# Altium project M3 ICE.PrjPcb
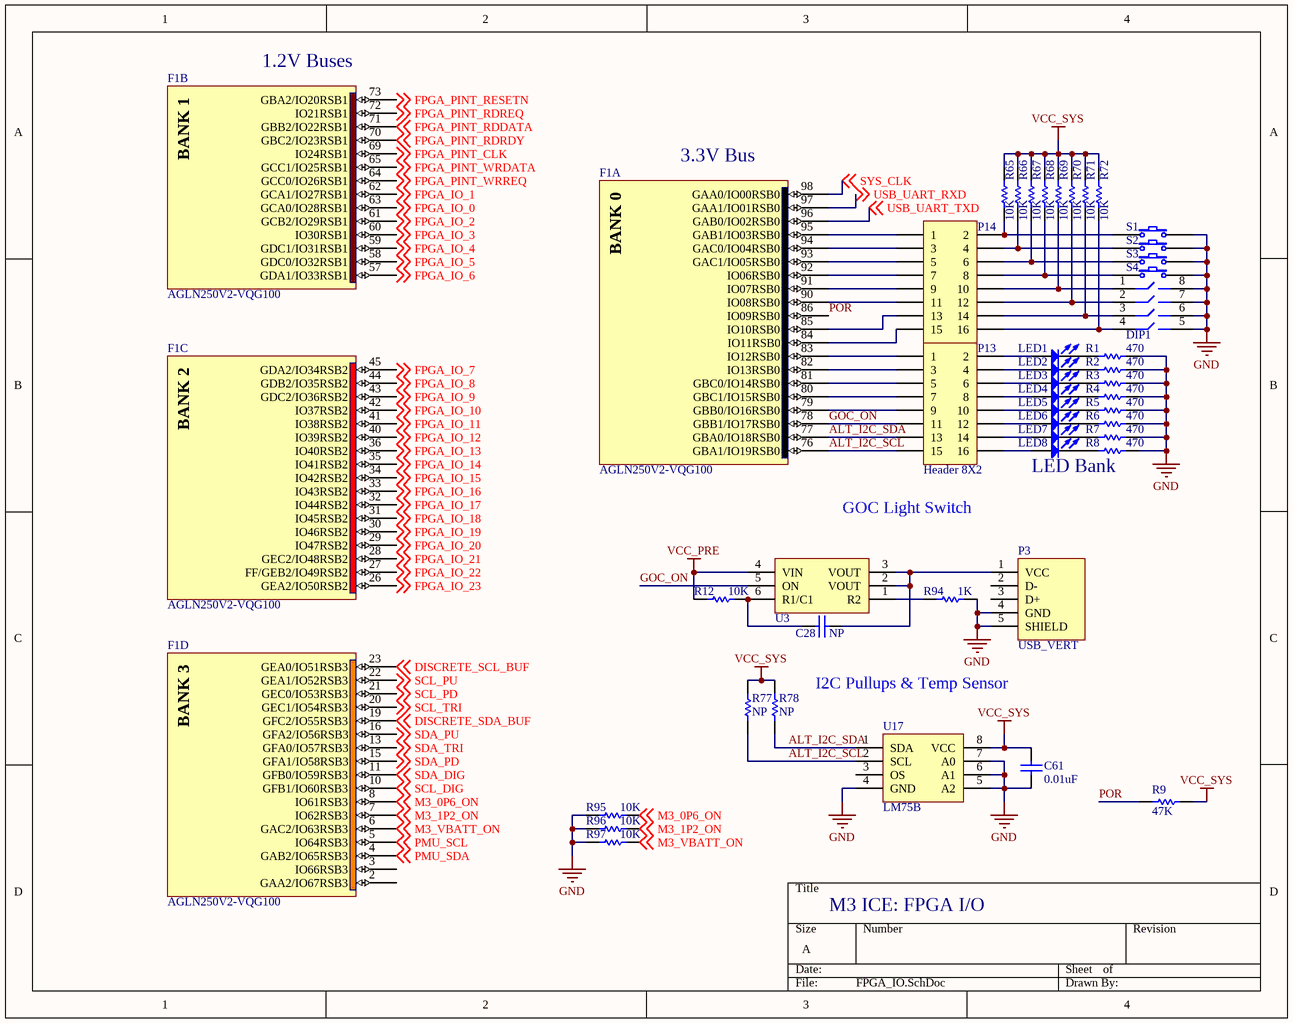
[diagram p0: FPGA_IO.SchDoc]
5 sheets, 230 parts. Net scope: global (net labels, ports and power ports of the same name join across sheets).
Board files: M3 ICE.PcbDoc, Drill Guide.PcbDoc
Sheets:
  FPGA_IO.SchDoc
  Power.SchDoc
  FPGA_misc.SchDoc
  USB_to_UART.SchDoc
  M3_Chip.SchDoc

## Sheet FPGA_IO.SchDoc
size A

### Parts
C28  value NP  [0402]  (hidden comment: Cap Semi)
C61  value 0.01uF  [1608[0603]]  (hidden comment: Cap Semi)
DIP1  ADE0404  [DIP-8]  (value not drawn)
F1  AGLN250V2-VQG100  [VQ100_N]  (parts A,B,C,D of 8)
LED1  LED 1206  [1206_LED]  (value not drawn)
LED2  LED 1206  [1206_LED]  (value not drawn)
LED3  LED 1206  [1206_LED]  (value not drawn)
LED4  LED 1206  [1206_LED]  (value not drawn)
LED5  LED 1206  [1206_LED]  (value not drawn)
LED6  LED 1206  [1206_LED]  (value not drawn)
LED7  LED 1206  [1206_LED]  (value not drawn)
LED8  LED 1206  [1206_LED]  (value not drawn)
P3  USB_VERT  [USB_VERT]
P13  Header 8X2  [HDR2X8]
P14  Header 8X2  [HDR2X8]  (value not drawn)
R1  value 470  [0603]  (hidden comment: Res Chip)
R2  value 470  [0603]  (hidden comment: Res Chip)
R3  value 470  [0603]  (hidden comment: Res Chip)
R4  value 470  [0603]  (hidden comment: Res Chip)
R5  value 470  [0603]  (hidden comment: Res Chip)
R6  value 470  [0603]  (hidden comment: Res Chip)
R7  value 470  [0603]  (hidden comment: Res Chip)
R8  value 470  [0603]  (hidden comment: Res Chip)
R9  value 47K  [0603]  (hidden comment: Res Chip)
R12  value 10K  [0402]  (hidden comment: Res Chip)
R65  value 10K  [0603]  (hidden comment: Res Chip)
R66  value 10K  [0603]  (hidden comment: Res Chip)
R67  value 10K  [0603]  (hidden comment: Res Chip)
R68  value 10K  [0603]  (hidden comment: Res Chip)
R69  value 10K  [0603]  (hidden comment: Res Chip)
R70  value 10K  [0603]  (hidden comment: Res Chip)
R71  value 10K  [0603]  (hidden comment: Res Chip)
R72  value 10K  [0603]  (hidden comment: Res Chip)
R77  value NP  [0603]  (hidden comment: Res Chip)
R78  value NP  [0603]  (hidden comment: Res Chip)
R94  value 1K  [0402]  (hidden comment: Res Chip)
R95  value 10K  [0402]  (hidden comment: Res Chip)
R96  value 10K  [0402]  (hidden comment: Res Chip)
R97  value 10K  [0402]  (hidden comment: Res Chip)
S1  EVQ-PAE04M  [EVQPA]  (value not drawn)
S2  EVQ-PAE04M  [EVQPA]  (value not drawn)
S3  EVQ-PAE04M  [EVQPA]  (value not drawn)
S4  EVQ-PAE04M  [EVQPA]  (value not drawn)
U3  FDC6330L  [SUPERSOT-6]  (value not drawn)
U17  LM75B  [SO8]

### Nets
GND: C61.1 DIP1.5 DIP1.6 DIP1.7 DIP1.8 P3.4(GND) P3.5(SHIELD) R1.1 R2.1 R3.1 R4.1 R5.1 R6.1 R7.1 R8.1 R94.2 R95.2 R96.2 R97.2 S1.2 S2.2 S3.2 S4.2 U17.4(GND) U17.5(A2) U17.6(A1) U17.7(A0)
VCC_PRE: R12.1 U3.4(VIN)
VCC_SYS: C61.2 R9.2 R65.1 R66.1 R67.1 R68.1 R69.1 R70.1 R71.1 R72.1 R77.1 R78.1 U17.8(VCC)  [project net VCC_B0]
ALT_I2C_SCL: F1.76(GBA1/IO19RSB0) P13.15 R77.2 U17.2(SCL)
ALT_I2C_SDA: F1.77(GBA0/IO18RSB0) P13.13 R78.2 U17.1(SDA)
DISCRETE_SCL_BUF: F1.23(GEA0/IO51RSB3) ; off-sheet DISCRETE_SCL_BUF
DISCRETE_SDA_BUF: F1.19(GFC2/IO55RSB3) ; off-sheet DISCRETE_SDA_BUF
FPGA_IO_0: F1.63(GCA0/IO28RSB1) ; off-sheet FPGA_IO_0
FPGA_IO_1: F1.62(GCA1/IO27RSB1) ; off-sheet FPGA_IO_1
FPGA_IO_2: F1.61(GCB2/IO29RSB1) ; off-sheet FPGA_IO_2
FPGA_IO_3: F1.60(IO30RSB1) ; off-sheet FPGA_IO_3
FPGA_IO_4: F1.59(GDC1/IO31RSB1) ; off-sheet FPGA_IO_4
FPGA_IO_5: F1.58(GDC0/IO32RSB1) ; off-sheet FPGA_IO_5
FPGA_IO_6: F1.57(GDA1/IO33RSB1) ; off-sheet FPGA_IO_6
FPGA_IO_7: F1.45(GDA2/IO34RSB2) ; off-sheet FPGA_IO_7
FPGA_IO_8: F1.44(GDB2/IO35RSB2) ; off-sheet FPGA_IO_8
FPGA_IO_9: F1.43(GDC2/IO36RSB2) ; off-sheet FPGA_IO_9
FPGA_IO_10: F1.42(IO37RSB2) ; off-sheet FPGA_IO_10
FPGA_IO_11: F1.41(IO38RSB2) ; off-sheet FPGA_IO_11
FPGA_IO_12: F1.40(IO39RSB2) ; off-sheet FPGA_IO_12
FPGA_IO_13: F1.36(IO40RSB2) ; off-sheet FPGA_IO_13
FPGA_IO_14: F1.35(IO41RSB2) ; off-sheet FPGA_IO_14
FPGA_IO_15: F1.34(IO42RSB2) ; off-sheet FPGA_IO_15
FPGA_IO_16: F1.33(IO43RSB2) ; off-sheet FPGA_IO_16
FPGA_IO_17: F1.32(IO44RSB2) ; off-sheet FPGA_IO_17
FPGA_IO_18: F1.31(IO45RSB2) ; off-sheet FPGA_IO_18
FPGA_IO_19: F1.30(IO46RSB2) ; off-sheet FPGA_IO_19
FPGA_IO_20: F1.29(IO47RSB2) ; off-sheet FPGA_IO_20
FPGA_IO_21: F1.28(GEC2/IO48RSB2) ; off-sheet FPGA_IO_21
FPGA_IO_22: F1.27(FF/GEB2/IO49RSB2) ; off-sheet FPGA_IO_22
FPGA_IO_23: F1.26(GEA2/IO50RSB2) ; off-sheet FPGA_IO_23
FPGA_PINT_CLK: F1.69(IO24RSB1) ; off-sheet FPGA_PINT_CLK
FPGA_PINT_RDDATA: F1.71(GBB2/IO22RSB1) ; off-sheet FPGA_PINT_RDDATA
FPGA_PINT_RDRDY: F1.70(GBC2/IO23RSB1) ; off-sheet FPGA_PINT_RDRDY
FPGA_PINT_RDREQ: F1.72(IO21RSB1) ; off-sheet FPGA_PINT_RDREQ
FPGA_PINT_RESETN: F1.73(GBA2/IO20RSB1) ; off-sheet FPGA_PINT_RESETN
FPGA_PINT_WRDATA: F1.65(GCC1/IO25RSB1) ; off-sheet FPGA_PINT_WRDATA
FPGA_PINT_WRREQ: F1.64(GCC0/IO26RSB1) ; off-sheet FPGA_PINT_WRREQ
GOC_ON: F1.78(GBB1/IO17RSB0) P13.11 U3.5(ON)
M3_0P6_ON: F1.8(IO61RSB3) R95.1 ; off-sheet M3_0P6_ON
M3_1P2_ON: F1.7(IO62RSB3) R96.1 ; off-sheet M3_1P2_ON
M3_VBATT_ON: F1.6(GAC2/IO63RSB3) R97.1 ; off-sheet M3_VBATT_ON
PMU_SCL: F1.5(IO64RSB3) ; off-sheet PMU_SCL
PMU_SDA: F1.4(GAB2/IO65RSB3) ; off-sheet PMU_SDA
POR: F1.86(IO09RSB0) R9.1
SCL_DIG: F1.10(GFB1/IO60RSB3) ; off-sheet SCL_DIG
SCL_PD: F1.21(GEC0/IO53RSB3) ; off-sheet SCL_PD
SCL_PU: F1.22(GEA1/IO52RSB3) ; off-sheet SCL_PU
SCL_TRI: F1.20(GEC1/IO54RSB3) ; off-sheet SCL_TRI
SDA_DIG: F1.11(GFB0/IO59RSB3) ; off-sheet SDA_DIG
SDA_PD: F1.15(GFA1/IO58RSB3) ; off-sheet SDA_PD
SDA_PU: F1.16(GFA2/IO56RSB3) ; off-sheet SDA_PU
SDA_TRI: F1.13(GFA0/IO57RSB3) ; off-sheet SDA_TRI
SYS_CLK: F1.98(GAA0/IO00RSB0) ; off-sheet SYS_CLK
USB_UART_RXD: F1.97(GAA1/IO01RSB0) ; off-sheet USB_UART_RXD
USB_UART_TXD: F1.96(GAB0/IO02RSB0) ; off-sheet USB_UART_TXD
NetC28_1: C28.1 P3.1(VCC) U3.2(VOUT) U3.3(VOUT)
NetC28_2: C28.2 R12.2 U3.6(R1/C1)
NetDIP1_1: DIP1.1 P14.10 R69.2
NetDIP1_2: DIP1.2 P14.12 R70.2
NetDIP1_3: DIP1.3 P14.14 R71.2
NetDIP1_4: DIP1.4 P14.16 R72.2
NetF1_79: F1.79(GBB0/IO16RSB0) P13.9
NetF1_80: F1.80(GBC1/IO15RSB0) P13.7
NetF1_81: F1.81(GBC0/IO14RSB0) P13.5
NetF1_82: F1.82(IO13RSB0) P13.3
NetF1_83: F1.83(IO12RSB0) P13.1
NetF1_84: F1.84(IO11RSB0) P14.15
NetF1_85: F1.85(IO10RSB0) P14.13
NetF1_90: F1.90(IO08RSB0) P14.11
NetF1_91: F1.91(IO07RSB0) P14.9
NetF1_92: F1.92(IO06RSB0) P14.7
NetF1_93: F1.93(GAC1/IO05RSB0) P14.5
NetF1_94: F1.94(GAC0/IO04RSB0) P14.3
NetF1_95: F1.95(GAB1/IO03RSB0) P14.1
NetLED1_1: LED1.1(A) P13.2
NetLED1_2: LED1.2(K) R1.2
NetLED2_1: LED2.1(A) P13.4
NetLED2_2: LED2.2(K) R2.2
NetLED3_1: LED3.1(A) P13.6
NetLED3_2: LED3.2(K) R3.2
NetLED4_1: LED4.1(A) P13.8
NetLED4_2: LED4.2(K) R4.2
NetLED5_1: LED5.1(A) P13.10
NetLED5_2: LED5.2(K) R5.2
NetLED6_1: LED6.1(A) P13.12
NetLED6_2: LED6.2(K) R6.2
NetLED7_1: LED7.1(A) P13.14
NetLED7_2: LED7.2(K) R7.2
NetLED8_1: LED8.1(A) P13.16
NetLED8_2: LED8.2(K) R8.2
NetP14_2: P14.2 R65.2 S1.1
NetP14_4: P14.4 R66.2 S2.1
NetP14_6: P14.6 R67.2 S3.1
NetP14_8: P14.8 R68.2 S4.1
NetR94_1: R94.1 U3.1(R2)

Not connected (* = marked no-connect by the designer): F1 2(GAA2/IO67RSB3) 3(IO66RSB3); P3 2(D-) 3(D+); U17 3(OS)

### Notes on the sheet
- (near F1) 1.2V Buses
- (near F1) 3.3V Bus
- LED Bank
- GOC Light Switch
- I2C Pullups & Temp Sensor
- M3 ICE: FPGA I/O
- (in symbol AGLN250V2-VQG100, part A) BANK 0
- (in symbol AGLN250V2-VQG100, part B) BANK 1
- (in symbol AGLN250V2-VQG100, part C) BANK 2
- (in symbol AGLN250V2-VQG100, part D) BANK 3

### Library data of the parts
C28 = Cap Semi: Capacitor (Semiconductor SIM Model); Published: 8-Jun-2000; LatestRevisionDate: 29-May-2009; LatestRevisionNote: IPC-7351 Footprint Added.; PackageReference: C1206; Publisher: Altium Limited; PackageDescription: Chip Capacitor
C61 = Cap Semi: Capacitor (Semiconductor SIM Model); DistPartNo: 445-1311-1-ND; ManPartNo: C1608X7R1H103K; Published: 8-Jun-2000; LatestRevisionDate: 29-May-2009; LatestRevisionNote: IPC-7351 Footprint Added.; PackageReference: C1206; Publisher: Altium Limited; PackageDescription: Chip Capacitor
DIP1 = ADE0404: 4-DIP Switch; DistPartNo: 450-1364-ND; PackageReference: DIP-8; ManPartNo: ADE0404
F1 = AGLN250V2-VQG100: IGLOO nano Low-Power Flash 1.2 to 1.5V FPGA with Flash*Freeze, 68 User IOs, 250K System Gates, 1Kbit Flash ROM, 100-Pin TQFP, Commercial Grade, Pb-Free; DistPartNo: 1100-1134-ND; Published: 29-May-2009; DatasheetVersion: Feb-2009; PackageVersion: v11.0, Feb-2009; PackageReference: VQ100; Publisher: Altium Limited; PackageDescription: 100-Pin Plastic Quad Flat Pack (VQ100); Code_JEDEC: MS-026-AED; ComponentLink1Description: Manufacturer Link; ComponentLink1URL: http://www.actel.com/products/igloonano/default.aspx; ComponentLink2Description: Datasheet; ComponentLink2URL: http://www.actel.com/documents/IGLOO_nano_DS.pdf; ManPartNo: AGLN250V2-VQG100
LED1-LED8 = LED 1206: DistPartNo: 160-1169-1-ND; ManPartNo: LTST-C150GKT
P3 = USB_VERT: DistPartNo: ED2987-ND; ManPartNo: USB-A1VSW6
P13 P14 = Header 8X2: Header, 8-Pin, Dual row; LatestRevisionDate: 17-Jul-2002; LatestRevisionNote: Re-released for DXP Platform.; Publisher: Altium Limited
R1-R8 = Res Chip: Semiconductor Resistor; DistPartNo: P470GCT-ND; ManPartNo: ERJ-3GEYJ471V; Published: 8-Jun-2000; LatestRevisionDate: 17-Jul-2002; LatestRevisionNote: Re-released for DXP Platform.; PackageReference: AXIAL-0.5; Publisher: Altium Limited; PackageDescription: Axial Device, Thru-Hole; 2 Leads; 0.5 in Pin Spacing
R9 = Res Chip: Semiconductor Resistor; DistPartNo: P47KGCT-ND; ManPartNo: ERJ-3GEYJ103V; Published: 8-Jun-2000; LatestRevisionDate: 17-Jul-2002; LatestRevisionNote: Re-released for DXP Platform.; PackageReference: AXIAL-0.5; Publisher: Altium Limited; PackageDescription: Axial Device, Thru-Hole; 2 Leads; 0.5 in Pin Spacing
R12 = Res Chip: Semiconductor Resistor; ManPartNo: ERJ-2RKF1002X; DistPartNo: P10.0KLCT-ND; Published: 8-Jun-2000; LatestRevisionDate: 17-Jul-2002; LatestRevisionNote: Re-released for DXP Platform.; PackageReference: AXIAL-0.5; Publisher: Altium Limited; PackageDescription: Axial Device, Thru-Hole; 2 Leads; 0.5 in Pin Spacing
R65-R72 = Res Chip: Semiconductor Resistor; DistPartNo: P10KGCT-ND; ManPartNo: ERJ-3GEYJ103V; Published: 8-Jun-2000; LatestRevisionDate: 17-Jul-2002; LatestRevisionNote: Re-released for DXP Platform.; PackageReference: AXIAL-0.5; Publisher: Altium Limited; PackageDescription: Axial Device, Thru-Hole; 2 Leads; 0.5 in Pin Spacing
R77 R78 = Res Chip: Semiconductor Resistor; DistPartNo: NONE; Published: 8-Jun-2000; LatestRevisionDate: 17-Jul-2002; LatestRevisionNote: Re-released for DXP Platform.; PackageReference: AXIAL-0.5; Publisher: Altium Limited; PackageDescription: Axial Device, Thru-Hole; 2 Leads; 0.5 in Pin Spacing; ManPartNo: NONE
R94 = Res Chip: Semiconductor Resistor; ManPartNo: ERJ-2RKF1001X; DistPartNo: P1.00KLCT-ND; Published: 8-Jun-2000; LatestRevisionDate: 17-Jul-2002; LatestRevisionNote: Re-released for DXP Platform.; PackageReference: AXIAL-0.5; Publisher: Altium Limited; PackageDescription: Axial Device, Thru-Hole; 2 Leads; 0.5 in Pin Spacing
R95-R97 = Res Chip: Semiconductor Resistor; DistPartNo: P10.0KLCT-ND; ManPartNo: ERJ-2RKF1002X; Published: 8-Jun-2000; LatestRevisionDate: 17-Jul-2002; LatestRevisionNote: Re-released for DXP Platform.; PackageReference: AXIAL-0.5; Publisher: Altium Limited; PackageDescription: Axial Device, Thru-Hole; 2 Leads; 0.5 in Pin Spacing
S1-S4 = EVQ-PAE04M: Switch Push; DistPartNo: P8008S-ND; ManPartNo: EVQ-PAE04M
U3 = FDC6330L: HS Switch; DistPartNo: FDC6330LCT-ND; ManPartNo: FDC6330L
U17 = LM75B: I2C Temp Sensor; DistPartNo: 568-4688-1-ND; ManPartNo: LM75BD,118

## Sheet Power.SchDoc
size A
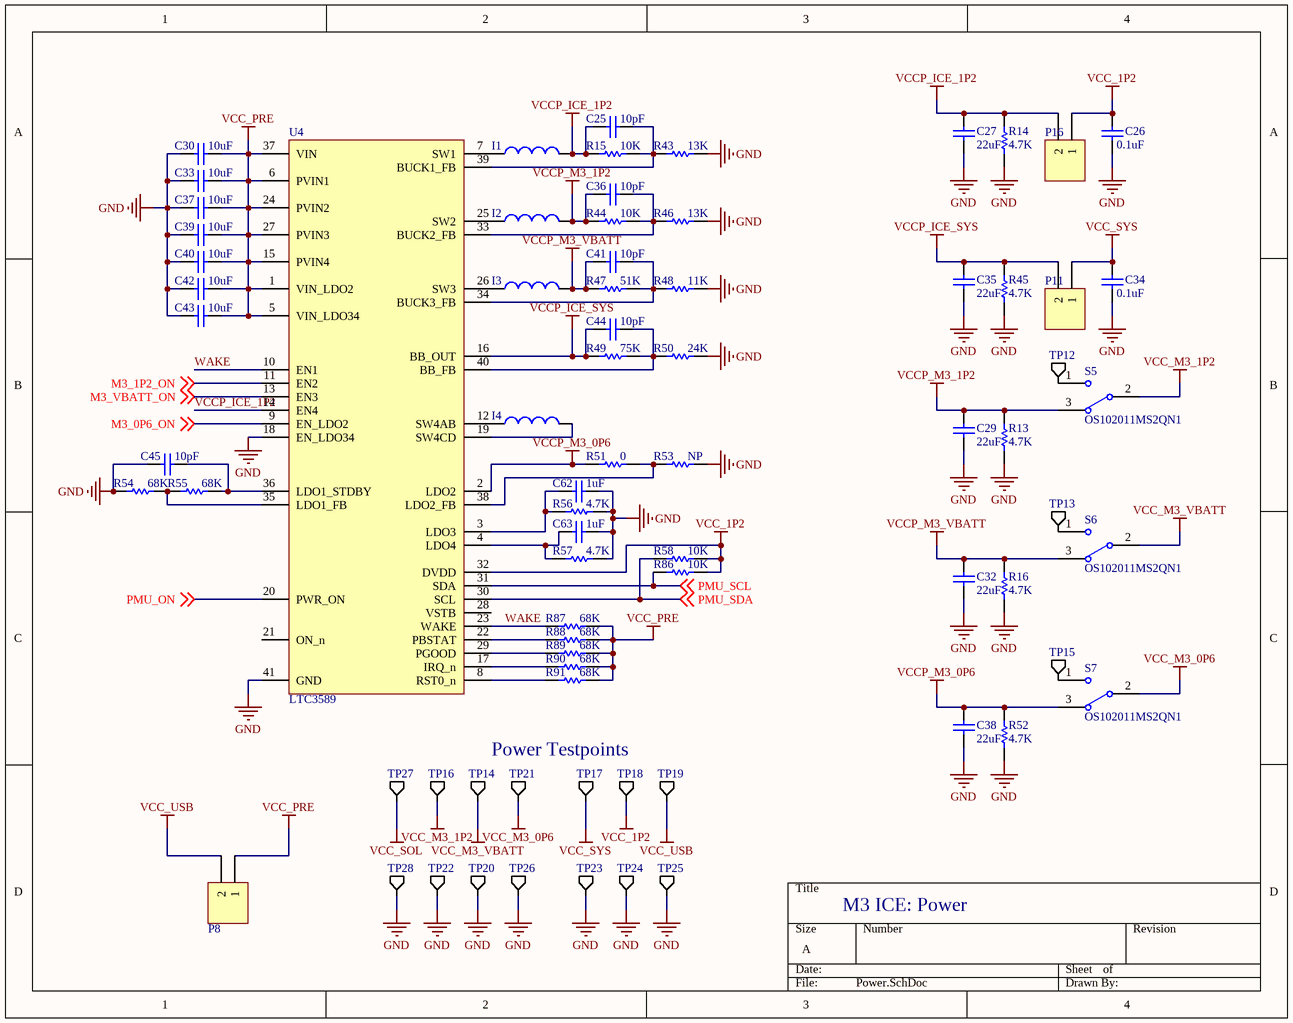
[diagram p1: Power.SchDoc]

### Parts
C25  value 10pF  [0402]  (hidden comment: Cap Semi)
C26  value 0.1uF  [1608[0603]]  (hidden comment: Cap Semi)
C27  value 22uF  [0805]  (hidden comment: Cap Chip)
C29  value 22uF  [0805]  (hidden comment: Cap Chip)
C30  value 10uF  [0805]  (hidden comment: Cap Chip)
C32  value 22uF  [0805]  (hidden comment: Cap Chip)
C33  value 10uF  [0805]  (hidden comment: Cap Chip)
C34  value 0.1uF  [1608[0603]]  (hidden comment: Cap Semi)
C35  value 22uF  [0805]  (hidden comment: Cap Chip)
C36  value 10pF  [0402]  (hidden comment: Cap Semi)
C37  value 10uF  [0805]  (hidden comment: Cap Chip)
C38  value 22uF  [0805]  (hidden comment: Cap Chip)
C39  value 10uF  [0805]  (hidden comment: Cap Chip)
C40  value 10uF  [0805]  (hidden comment: Cap Chip)
C41  value 10pF  [0402]  (hidden comment: Cap Semi)
C42  value 10uF  [0805]  (hidden comment: Cap Chip)
C43  value 10uF  [0805]  (hidden comment: Cap Chip)
C44  value 10pF  [0402]  (hidden comment: Cap Semi)
C45  value 10pF  [0402]  (hidden comment: Cap Semi)
C62  value 1uF  [0402]  (hidden comment: Cap Semi)
C63  value 1uF  [0402]  (hidden comment: Cap Semi)
I1  NR5040T1R5N  [INDUCTOR_.118x.142mm]  (value not drawn)
I2  NR5040T1R5N  [INDUCTOR_.118x.142mm]  (value not drawn)
I3  NR5040T1R5N  [INDUCTOR_.118x.142mm]  (value not drawn)
I4  NR5040T1R5N  [INDUCTOR_.118x.142mm]  (value not drawn)
P8  Header 2  [HDR1X2]  (value not drawn)
P11  Header 2  [HDR1X2]  (value not drawn)
P16  Header 2  [HDR1X2]  (value not drawn)
R13  value 4.7K  [0603]  (hidden comment: Res Chip)
R14  value 4.7K  [0603]  (hidden comment: Res Chip)
R15  value 10K  [0402]  (hidden comment: Res Chip)
R16  value 4.7K  [0603]  (hidden comment: Res Chip)
R43  value 13K  [0402]  (hidden comment: Res Chip)
R44  value 10K  [0402]  (hidden comment: Res Chip)
R45  value 4.7K  [0603]  (hidden comment: Res Chip)
R46  value 13K  [0402]  (hidden comment: Res Chip)
R47  value 51K  [0402]  (hidden comment: Res Chip)
R48  value 11K  [0402]  (hidden comment: Res Chip)
R49  value 75K  [0402]  (hidden comment: Res Chip)
R50  value 24K  [0402]  (hidden comment: Res Chip)
R51  value 0  [0402]  (hidden comment: Res Chip)
R52  value 4.7K  [0603]  (hidden comment: Res Chip)
R53  value NP  [0402]  (hidden comment: Res Chip)
R54  value 68K  [0402]  (hidden comment: Res Chip)
R55  value 68K  [0402]  (hidden comment: Res Chip)
R56  value 4.7K  [0402]  (hidden comment: Res Chip)
R57  value 4.7K  [0402]  (hidden comment: Res Chip)
R58  value 10K  [0402]  (hidden comment: Res Chip)
R86  value 10K  [0402]  (hidden comment: Res Chip)
R87  value 68K  [0402]  (hidden comment: Res Chip)
R88  value 68K  [0402]  (hidden comment: Res Chip)
R89  value 68K  [0402]  (hidden comment: Res Chip)
R90  value 68K  [0402]  (hidden comment: Res Chip)
R91  value 68K  [0402]  (hidden comment: Res Chip)
S5  OS102011MS2QN1  [SPDT_SW2]
S6  OS102011MS2QN1  [SPDT_SW2]
S7  OS102011MS2QN1  [SPDT_SW2]
TP12  TP  [TP]  (value not drawn)
TP13  TP  [TP]  (value not drawn)
TP14  TP  [TP]  (value not drawn)
TP15  TP  [TP]  (value not drawn)
TP16  TP  [TP]  (value not drawn)
TP17  TP  [TP]  (value not drawn)
TP18  TP  [TP]  (value not drawn)
TP19  TP  [TP]  (value not drawn)
TP20  TP  [TP]  (value not drawn)
TP21  TP  [TP]  (value not drawn)
TP22  TP  [TP]  (value not drawn)
TP23  TP  [TP]  (value not drawn)
TP24  TP  [TP]  (value not drawn)
TP25  TP  [TP]  (value not drawn)
TP26  TP  [TP]  (value not drawn)
TP27  TP  [TP]  (value not drawn)
TP28  TP  [TP]  (value not drawn)
U4  LTC3589  [QFN-40]

### Nets
GND: C26.1 C27.1 C29.1 C30.2 C32.1 C33.2 C34.1 C35.1 C37.2 C38.1 C39.2 C40.2 C42.2 C43.2 C45.2 C62.1 C63.1 R13.1 R14.1 R16.1 R43.2 R45.1 R46.2 R48.2 R50.2 R52.1 R53.2 R54.1 R56.2 R57.2 TP20.1(A) TP22.1(A) TP23.1(A) TP24.1(A) TP25.1(A) TP26.1(A) TP28.1(A) U4.18(EN_LDO34) U4.41(GND)
VCC_1P2: C26.2 P16.1 R58.2 R86.2 TP18.1(A) U4.32(DVDD)
VCC_M3_0P6: S7.2 TP21.1(A)
VCC_M3_1P2: S5.2 TP16.1(A)
VCC_M3_VBATT: S6.2 TP14.1(A)
VCC_PRE: C30.1 C33.1 C37.1 C39.1 C40.1 C42.1 C43.1 P8.1 R87.2 R88.2 R89.2 R90.2 R91.2 U4.1(VIN_LDO2) U4.5(VIN_LDO34) U4.6(PVIN1) U4.15(PVIN4) U4.24(PVIN2) U4.27(PVIN3) U4.37(VIN)
VCC_SOL: TP27.1(A)
VCC_SYS: C34.2 P11.1 TP17.1(A)  [project net VCC_B0]
VCC_USB: P8.2 TP19.1(A)
VCCP_ICE_1P2: C25.2 C27.2 I1.2 P16.2 R14.2 R15.1 U4.14(EN4)
VCCP_ICE_SYS: C35.2 C44.2 P11.2 R45.2 R49.1 U4.16(BB_OUT)
VCCP_M3_0P6: C38.2 R51.1 R52.2 S7.3 U4.2(LDO2)
VCCP_M3_1P2: C29.2 C36.2 I2.2 R13.2 R44.1 S5.3
VCCP_M3_VBATT: C32.2 C41.2 I3.2 R16.2 R47.1 S6.3
M3_0P6_ON: U4.9(EN_LDO2) ; off-sheet M3_0P6_ON
M3_1P2_ON: U4.11(EN2) ; off-sheet M3_1P2_ON
M3_VBATT_ON: U4.13(EN3) ; off-sheet M3_VBATT_ON
PMU_ON: U4.20(PWR_ON) ; off-sheet PMU_ON
PMU_SCL: R86.1 U4.31(SDA) ; off-sheet PMU_SCL
PMU_SDA: R58.1 U4.30(SCL) ; off-sheet PMU_SDA
WAKE: R87.1 U4.10(EN1) U4.23(WAKE)
NetC25_1: C25.1 R15.2 R43.1 U4.39(BUCK1_FB)
NetC36_1: C36.1 R44.2 R46.1 U4.33(BUCK2_FB)
NetC41_1: C41.1 R47.2 R48.1 U4.34(BUCK3_FB)
NetC44_1: C44.1 R49.2 R50.1 U4.40(BB_FB)
NetC45_1: C45.1 R55.2 U4.36(LDO1_STDBY)
NetC62_2: C62.2 R56.1 U4.3(LDO3)
NetC63_2: C63.2 R57.1 U4.4(LDO4)
NetI1_1: I1.1 U4.7(SW1)
NetI2_1: I2.1 U4.25(SW2)
NetI3_1: I3.1 U4.26(SW3)
NetI4_1: I4.1 U4.12(SW4AB)
NetI4_2: I4.2 U4.19(SW4CD)
NetR51_2: R51.2 R53.1 U4.38(LDO2_FB)
NetR54_2: R54.2 R55.1 U4.35(LDO1_FB)
NetR88_1: R88.1 U4.22(PBSTAT)
NetR89_1: R89.1 U4.29(PGOOD)
NetR90_1: R90.1 U4.17(IRQ_n)
NetR91_1: R91.1 U4.8(RST0_n)
NetS5_1: S5.1 TP12.1(A)
NetS6_1: S6.1 TP13.1(A)
NetS7_1: S7.1 TP15.1(A)

Not connected (* = marked no-connect by the designer): U4 21(ON_n) 28(VSTB)

### Notes on the sheet
- Power Testpoints
- M3 ICE: Power

### Library data of the parts
C25 C36 C41 C44 C45 = Cap Semi: Capacitor (Semiconductor SIM Model); DistPartNo: 445-1235-1-ND; ManPartNo: C1005C0G1H100D; Published: 8-Jun-2000; LatestRevisionDate: 29-May-2009; LatestRevisionNote: IPC-7351 Footprint Added.; PackageReference: C1206; Publisher: Altium Limited; PackageDescription: Chip Capacitor
C26 C34 = Cap Semi: Capacitor (Semiconductor SIM Model); DistPartNo: 445-1317-1-ND; ManPartNo: C1608X7R1C104K; Published: 8-Jun-2000; LatestRevisionDate: 29-May-2009; LatestRevisionNote: IPC-7351 Footprint Added.; PackageReference: C1206; Publisher: Altium Limited; PackageDescription: Chip Capacitor
C27 C29 C32 C35 C38 = Cap Chip: Capacitor (Semiconductor SIM Model); DistPartNo: 587-2782-1-ND; ManPartNo: LMK316AB7226ML-TR; Published: 8-Jun-2000; LatestRevisionDate: 29-May-2009; LatestRevisionNote: IPC-7351 Footprint Added.; PackageReference: C1206; Publisher: Altium Limited; PackageDescription: Chip Capacitor
C30 C33 C37 C39 C40 C42 C43 = Cap Chip: Capacitor (Semiconductor SIM Model); DistPartNo: 445-6857-1-ND; ManPartNo: C2012X7R1A106K; Published: 8-Jun-2000; LatestRevisionDate: 29-May-2009; LatestRevisionNote: IPC-7351 Footprint Added.; PackageReference: C1206; Publisher: Altium Limited; PackageDescription: Chip Capacitor
C62 C63 = Cap Semi: Capacitor (Semiconductor SIM Model); DistPartNo: 445-4991-1-ND; ManPartNo: C1005X5R1A105M; Published: 8-Jun-2000; LatestRevisionDate: 29-May-2009; LatestRevisionNote: IPC-7351 Footprint Added.; PackageReference: C1206; Publisher: Altium Limited; PackageDescription: Chip Capacitor
I1-I4 = IHLP1212: DistPartNo: 541-1327-1-ND; ManPartNo: IHLP1212AEER1R0M11
P8 P11 P16 = Header 2: Header, 2-Pin; LatestRevisionDate: 17-Jul-2002; LatestRevisionNote: Re-released for DXP Platform.; Publisher: Altium Limited
R13 R14 R16 R45 R52 = Res Chip: Semiconductor Resistor; DistPartNo: P4.7KGCT-ND; ManPartNo: ERJ-3GEYJ472V; Published: 8-Jun-2000; LatestRevisionDate: 17-Jul-2002; LatestRevisionNote: Re-released for DXP Platform.; PackageReference: AXIAL-0.5; Publisher: Altium Limited; PackageDescription: Axial Device, Thru-Hole; 2 Leads; 0.5 in Pin Spacing
R15 R44 R58 R86 = Res Chip: as R95 on sheet FPGA_IO; Published: 8-Jun-2000; LatestRevisionDate: 17-Jul-2002; LatestRevisionNote: Re-released for DXP Platform.; PackageReference: AXIAL-0.5; Publisher: Altium Limited; PackageDescription: Axial Device, Thru-Hole; 2 Leads; 0.5 in Pin Spacing
R43 R46 = Res Chip: Semiconductor Resistor; DistPartNo: 311-13.0KLRCT-ND; ManPartNo: RC0402FR-0713KL; Published: 8-Jun-2000; LatestRevisionDate: 17-Jul-2002; LatestRevisionNote: Re-released for DXP Platform.; PackageReference: AXIAL-0.5; Publisher: Altium Limited; PackageDescription: Axial Device, Thru-Hole; 2 Leads; 0.5 in Pin Spacing
R47 = Res Chip: Semiconductor Resistor; DistPartNo: P51.0KLCT-ND; ManPartNo: ERJ-2RKF5102X; Published: 8-Jun-2000; LatestRevisionDate: 17-Jul-2002; LatestRevisionNote: Re-released for DXP Platform.; PackageReference: AXIAL-0.5; Publisher: Altium Limited; PackageDescription: Axial Device, Thru-Hole; 2 Leads; 0.5 in Pin Spacing
R48 = Res Chip: Semiconductor Resistor; DistPartNo: P11.0KLCT-ND; ManPartNo: ERJ-2RKF1102X; Published: 8-Jun-2000; LatestRevisionDate: 17-Jul-2002; LatestRevisionNote: Re-released for DXP Platform.; PackageReference: AXIAL-0.5; Publisher: Altium Limited; PackageDescription: Axial Device, Thru-Hole; 2 Leads; 0.5 in Pin Spacing
R49 = Res Chip: Semiconductor Resistor; DistPartNo: P75.0KLCT-ND; ManPartNo: ERJ-2RKF7502X; Published: 8-Jun-2000; LatestRevisionDate: 17-Jul-2002; LatestRevisionNote: Re-released for DXP Platform.; PackageReference: AXIAL-0.5; Publisher: Altium Limited; PackageDescription: Axial Device, Thru-Hole; 2 Leads; 0.5 in Pin Spacing
R50 = Res Chip: Semiconductor Resistor; DistPartNo: RMCF0402FT24K0CT-ND; ManPartNo: RMCF0402FT24K0; Published: 8-Jun-2000; LatestRevisionDate: 17-Jul-2002; LatestRevisionNote: Re-released for DXP Platform.; PackageReference: AXIAL-0.5; Publisher: Altium Limited; PackageDescription: Axial Device, Thru-Hole; 2 Leads; 0.5 in Pin Spacing
R51 = Res Chip: Semiconductor Resistor; DistPartNo: P0.0JCT-ND; ManPartNo: ERJ-2GE0R00X; Published: 8-Jun-2000; LatestRevisionDate: 17-Jul-2002; LatestRevisionNote: Re-released for DXP Platform.; PackageReference: AXIAL-0.5; Publisher: Altium Limited; PackageDescription: Axial Device, Thru-Hole; 2 Leads; 0.5 in Pin Spacing
R53 = Res Chip: Semiconductor Resistor; Published: 8-Jun-2000; LatestRevisionDate: 17-Jul-2002; LatestRevisionNote: Re-released for DXP Platform.; PackageReference: AXIAL-0.5; Publisher: Altium Limited; PackageDescription: Axial Device, Thru-Hole; 2 Leads; 0.5 in Pin Spacing
R54 R55 R87-R91 = Res Chip: Semiconductor Resistor; DistPartNo: P68.0KLCT-ND; ManPartNo: ERJ-2RKF6802X; Published: 8-Jun-2000; LatestRevisionDate: 17-Jul-2002; LatestRevisionNote: Re-released for DXP Platform.; PackageReference: AXIAL-0.5; Publisher: Altium Limited; PackageDescription: Axial Device, Thru-Hole; 2 Leads; 0.5 in Pin Spacing
R56 R57 = Res Chip: Semiconductor Resistor; DistPartNo: P4.70KLCT-ND; ManPartNo: ERJ-2RKF4701X; Published: 8-Jun-2000; LatestRevisionDate: 17-Jul-2002; LatestRevisionNote: Re-released for DXP Platform.; PackageReference: AXIAL-0.5; Publisher: Altium Limited; PackageDescription: Axial Device, Thru-Hole; 2 Leads; 0.5 in Pin Spacing
S5-S7 = OS102011MS2QN1: SPDT Slide Switch; DistPartNo: CKN9565-ND; ManPartNo: OS102011MS2QN1
U4 = LTC3589: DistPartNo: LTC3589EUJ-2#PBF-ND; ManPartNo: LTC3589EUJ-2#PBF

## Sheet FPGA_misc.SchDoc
size A
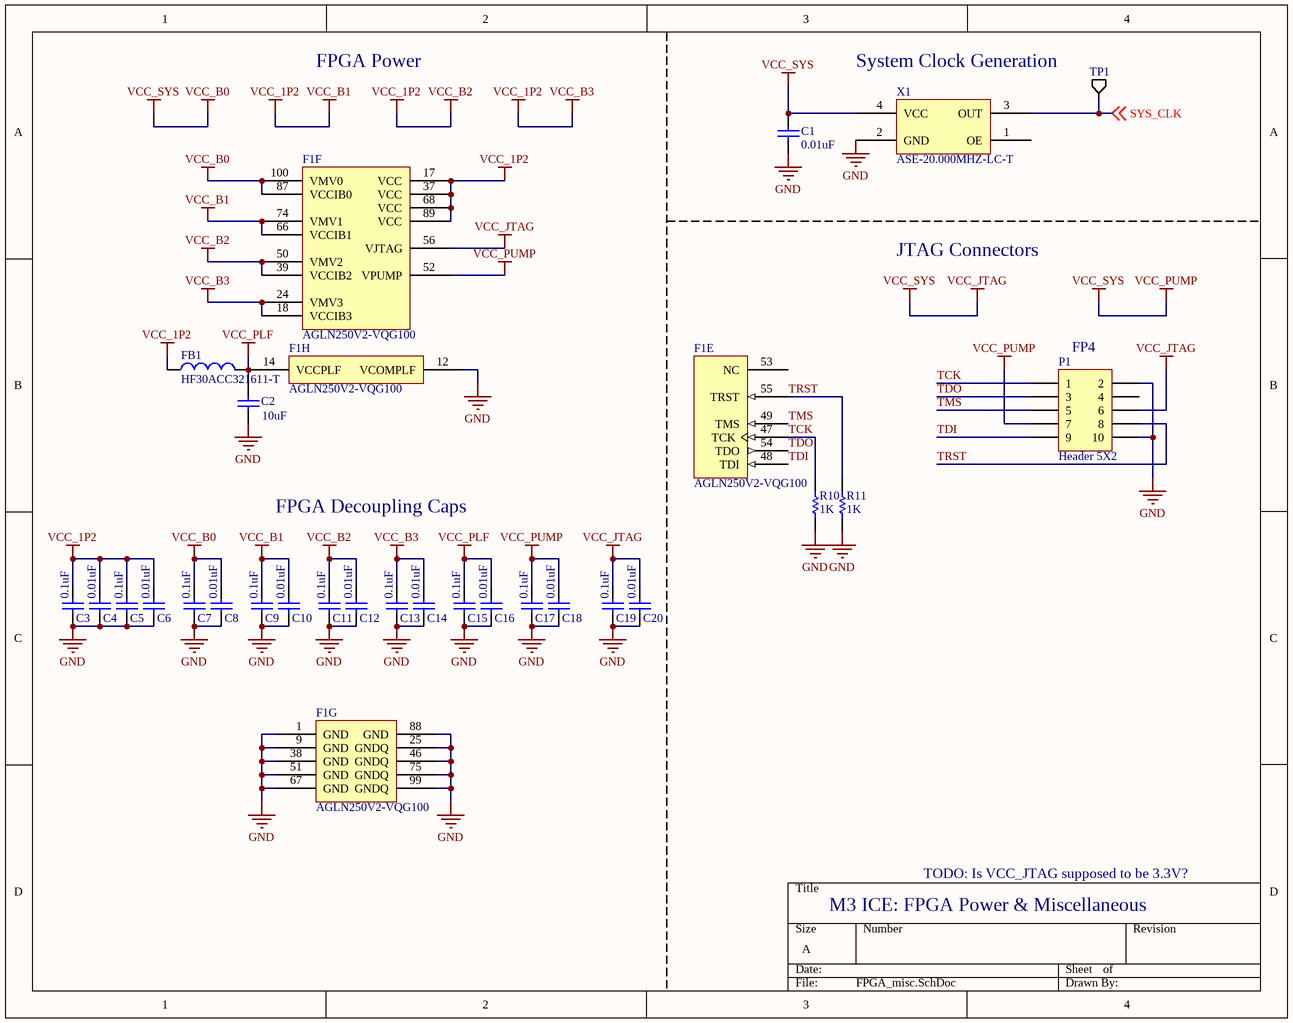
[diagram p2: FPGA_misc.SchDoc]

### Parts
C1  value 0.01uF  [1608[0603]]  (hidden comment: Cap Semi)
C2  value 10uF  [0805]  (hidden comment: Cap Chip)
C3  value 0.1uF  [1608[0603]]  (hidden comment: Cap Semi)
C4  value 0.01uF  [1608[0603]]  (hidden comment: Cap Semi)
C5  value 0.1uF  [1608[0603]]  (hidden comment: Cap Semi)
C6  value 0.01uF  [1608[0603]]  (hidden comment: Cap Semi)
C7  value 0.1uF  [1608[0603]]  (hidden comment: Cap Semi)
C8  value 0.01uF  [1608[0603]]  (hidden comment: Cap Semi)
C9  value 0.1uF  [1608[0603]]  (hidden comment: Cap Semi)
C10  value 0.01uF  [1608[0603]]  (hidden comment: Cap Semi)
C11  value 0.1uF  [1608[0603]]  (hidden comment: Cap Semi)
C12  value 0.01uF  [1608[0603]]  (hidden comment: Cap Semi)
C13  value 0.1uF  [1608[0603]]  (hidden comment: Cap Semi)
C14  value 0.01uF  [1608[0603]]  (hidden comment: Cap Semi)
C15  value 0.1uF  [1608[0603]]  (hidden comment: Cap Semi)
C16  value 0.01uF  [1608[0603]]  (hidden comment: Cap Semi)
C17  value 0.1uF  [1608[0603]]  (hidden comment: Cap Semi)
C18  value 0.01uF  [1608[0603]]  (hidden comment: Cap Semi)
C19  value 0.1uF  [1608[0603]]  (hidden comment: Cap Semi)
C20  value 0.01uF  [1608[0603]]  (hidden comment: Cap Semi)
F1  AGLN250V2-VQG100  [VQ100_N]  (parts E,F,G,H of 8)
FB1  HF30ACC321611-T  [Ferrite_Bead_3.2mm_1.6mm]
P1  Header 5X2  [HDR2X5]
R10  value 1K  [0603]  (hidden comment: Res Chip)
R11  value 1K  [0603]  (hidden comment: Res Chip)
TP1  TP  [TP]  (value not drawn)
X1  ASE-20.000MHZ-LC-T  [CRYSTAL_3.2mm_2.5mm]

### Nets
GND: C1.1 C2.1 C3.1 C4.1 C5.1 C6.1 C7.1 C8.1 C9.1 C10.1 C11.1 C12.1 C13.1 C14.1 C15.1 C16.1 C17.1 C18.1 C19.1 C20.1 F1.1(GND) F1.9(GND) F1.12(VCOMPLF) F1.25(GNDQ) F1.38(GND) F1.46(GNDQ) F1.51(GND) F1.67(GND) F1.75(GNDQ) F1.88(GND) F1.99(GNDQ) P1.2 P1.10 R10.2 R11.2 X1.2(GND)
VCC_1P2: C3.2 C4.2 C5.2 C6.2 C9.2 C10.2 C11.2 C12.2 C13.2 C14.2 F1.17(VCC) F1.18(VCCIB3) F1.24(VMV3) F1.37(VCC) F1.39(VCCIB2) F1.50(VMV2) F1.66(VCCIB1) F1.68(VCC) F1.74(VMV1) F1.89(VCC) FB1.1  [also labelled VCC_B1, VCC_B2, VCC_B3]
VCC_B0: C1.2 C7.2 C8.2 C17.2 C18.2 C19.2 C20.2 F1.52(VPUMP) F1.56(VJTAG) F1.87(VCCIB0) F1.100(VMV0) P1.6 P1.7 X1.4(VCC)  [also labelled VCC_JTAG, VCC_PUMP, VCC_SYS]
VCC_PLF: C2.2 C15.2 C16.2 F1.14(VCCPLF) FB1.2
SYS_CLK: TP1.1(A) X1.3(OUT) ; off-sheet SYS_CLK
TCK: F1.47(TCK) P1.1 R10.1
TDI: F1.48(TDI) P1.9
TDO: F1.54(TDO) P1.3
TMS: F1.49(TMS) P1.5
TRST: F1.55(TRST) P1.8 R11.1

Not connected (* = marked no-connect by the designer): F1 53(NC); P1 4; X1 1(OE)

### Notes on the sheet
- FPGA Power
- System Clock Generation
- JTAG Connectors
- (near P1) FP4
- FPGA Decoupling Caps
- M3 ICE: FPGA Power & Miscellaneous
- TODO: Is VCC_JTAG supposed to be 3.3V?

### Library data of the parts
C1 C4 C6 C8 C10 C12 C14 C16 C18 C20 = Cap Semi: as C61 on sheet FPGA_IO; Published: 8-Jun-2000; LatestRevisionDate: 29-May-2009; LatestRevisionNote: IPC-7351 Footprint Added.; PackageReference: C1206; Publisher: Altium Limited; PackageDescription: Chip Capacitor
C2 = Cap Chip: Capacitor (Semiconductor SIM Model); DistPartNo: 445-7645-1-ND; ManPartNo: C2012X5R1C106M/0.85; Published: 8-Jun-2000; LatestRevisionDate: 29-May-2009; LatestRevisionNote: IPC-7351 Footprint Added.; PackageReference: C1206; Publisher: Altium Limited; PackageDescription: Chip Capacitor
C3 C5 C7 C9 C11 C13 C15 C17 C19 = Cap Semi: as C26 on sheet Power; Published: 8-Jun-2000; LatestRevisionDate: 29-May-2009; LatestRevisionNote: IPC-7351 Footprint Added.; PackageReference: C1206; Publisher: Altium Limited; PackageDescription: Chip Capacitor
F1 = AGLN250V2-VQG100: as F1 on sheet FPGA_IO; Published: 29-May-2009; DatasheetVersion: Feb-2009; PackageVersion: v11.0, Feb-2009; PackageReference: VQ100; Publisher: Altium Limited; PackageDescription: 100-Pin Plastic Quad Flat Pack (VQ100); Code_JEDEC: MS-026-AED; ComponentLink1Description: Manufacturer Link; ComponentLink1URL: http://www.actel.com/products/igloonano/default.aspx; ComponentLink2Description: Datasheet; ComponentLink2URL: http://www.actel.com/documents/IGLOO_nano_DS.pdf; ManPartNo: AGLN250V2-VQG100
FB1 = Ferrite Bead HF30ACC321611-T: DistPartNo: 445-6165-1-ND; ManPartNo: HF30ACC321611-T
P1 = Header 5X2: Header, 5-Pin, Dual row; LatestRevisionDate: 17-Jul-2002; LatestRevisionNote: Re-released for DXP Platform.; Publisher: Altium Limited
R10 R11 = Res Chip: Semiconductor Resistor; DistPartNo: P1.0KGCT-ND; ManPartNo: ERJ-3GEYJ102V; Published: 8-Jun-2000; LatestRevisionDate: 17-Jul-2002; LatestRevisionNote: Re-released for DXP Platform.; PackageReference: AXIAL-0.5; Publisher: Altium Limited; PackageDescription: Axial Device, Thru-Hole; 2 Leads; 0.5 in Pin Spacing
X1 = ASE-20.000MHZ-LC-T: DistPartNo: 535-9565-1-ND; ManPartNo: ASE-20.000MHZ-LC-T

## Sheet USB_to_UART.SchDoc
size A
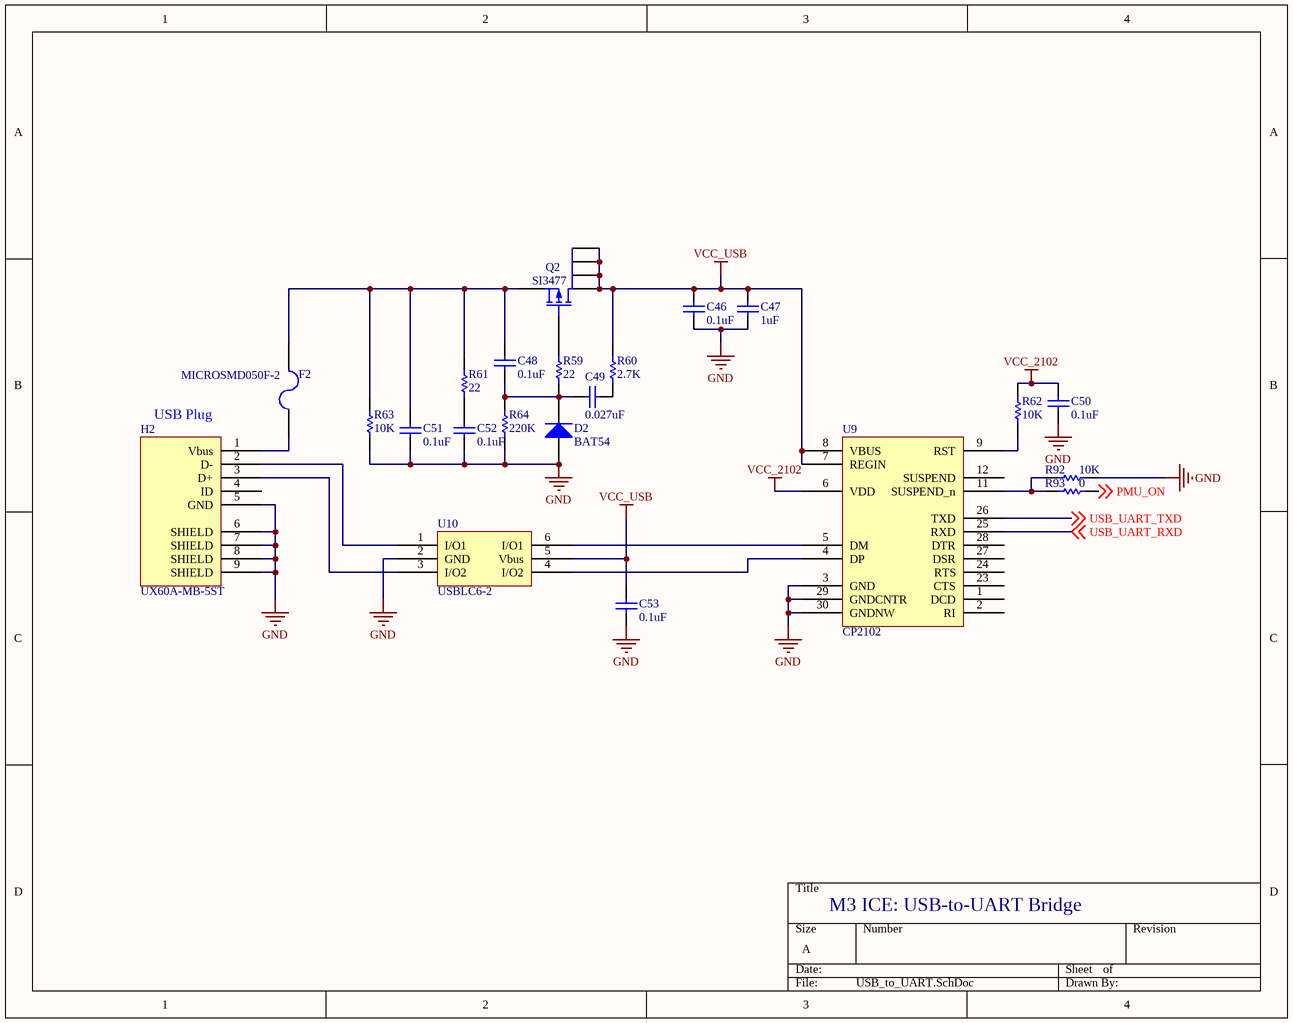
[diagram p3: USB_to_UART.SchDoc]

### Parts
C46  value 0.1uF  [1608[0603]]  (hidden comment: Cap Semi)
C47  value 1uF  [1608[0603]]  (hidden comment: Cap Semi)
C48  value 0.1uF  [1608[0603]]  (hidden comment: Cap Semi)
C49  value 0.027uF  [1608[0603]]  (hidden comment: Cap Semi)
C50  value 0.1uF  [1608[0603]]  (hidden comment: Cap Semi)
C51  value 0.1uF  [1608[0603]]  (hidden comment: Cap Semi)
C52  value 0.1uF  [1608[0603]]  (hidden comment: Cap Semi)
C53  value 0.1uF  [1608[0603]]  (hidden comment: Cap Semi)
D2  BAT54  [SOT-23_N]
F2  MICROSMD050F-2  [1210]
H2  UX60A-MB-5ST  [USB Mini-B]
Q2  SI3477  [TSOP-6]
R59  value 22  [0603]  (hidden comment: Res Chip)
R60  value 2.7K  [0603]  (hidden comment: Res Chip)
R61  value 22  [0603]  (hidden comment: Res Chip)
R62  value 10K  [0603]  (hidden comment: Res Chip)
R63  value 10K  [0603]  (hidden comment: Res Chip)
R64  value 220K  [0603]  (hidden comment: Res Chip)
R92  value 10K  [0402]  (hidden comment: Res Chip)
R93  value 0  [0402]  (hidden comment: Res Chip)
U9  CP2102  [QFN-28]
U10  USBLC6-2  [SOT23-6_L]

### Nets
GND: C46.1 C47.1 C50.1 C51.1 C52.1 C53.1 D2.1(A) H2.5(GND) H2.6(SHIELD) H2.7(SHIELD) H2.8(SHIELD) H2.9(SHIELD) R63.1 R64.1 R92.2 U9.3(GND) U9.29(GNDCNTR) U9.30(GNDNW) U10.2(GND)
VCC_2102: C50.2 R62.2 U9.6(VDD)
VCC_USB: C46.2 C47.2 C53.2 Q2.1(D) Q2.2(D) Q2.5(D) Q2.6(D) R60.2 U9.7(REGIN) U9.8(VBUS) U10.5(Vbus)
PMU_ON: R93.2 ; off-sheet PMU_ON
USB_UART_RXD: U9.25(RXD) ; off-sheet USB_UART_RXD
USB_UART_TXD: U9.26(TXD) ; off-sheet USB_UART_TXD
NetC48_1: C48.1 C49.2 D2.3(K) R59.1 R64.2
NetC48_2: C48.2 C51.2 F2.2 Q2.4(S) R61.2 R63.2
NetC49_1: C49.1 R60.1
NetC52_2: C52.2 R61.1
NetF2_1: F2.1 H2.1(Vbus)
NetH2_2: H2.2(D-) U10.1(I/O1)
NetH2_3: H2.3(D+) U10.3(I/O2)
NetQ2_3: Q2.3(G) R59.2
NetR62_1: R62.1 U9.9(RST)
NetR92_1: R92.1 R93.1 U9.11(SUSPEND_n)
NetU9_4: U9.4(DP) U10.4(I/O2)
NetU9_5: U9.5(DM) U10.6(I/O1)

Not connected (* = marked no-connect by the designer): H2 4(ID); U9 1(DCD) 2(RI) 12(SUSPEND) 23(CTS) 24(RTS) 27(DSR) 28(DTR)

### Notes on the sheet
- (near H2) USB Plug
- M3 ICE: USB-to-UART Bridge

### Library data of the parts
C46 C48 C50-C53 = Cap Semi: as C26 on sheet Power; Published: 8-Jun-2000; LatestRevisionDate: 29-May-2009; LatestRevisionNote: IPC-7351 Footprint Added.; PackageReference: C1206; Publisher: Altium Limited; PackageDescription: Chip Capacitor
C47 = Cap Semi: Capacitor (Semiconductor SIM Model); DistPartNo: 445-1327-1-ND; ManPartNo: C1608Y5V1C105Z; Published: 8-Jun-2000; LatestRevisionDate: 29-May-2009; LatestRevisionNote: IPC-7351 Footprint Added.; PackageReference: C1206; Publisher: Altium Limited; PackageDescription: Chip Capacitor
C49 = Cap Semi: Capacitor (Semiconductor SIM Model); DistPartNo: 478-1232-1-ND; ManPartNo: 06035C273KAT2A; Published: 8-Jun-2000; LatestRevisionDate: 29-May-2009; LatestRevisionNote: IPC-7351 Footprint Added.; PackageReference: C1206; Publisher: Altium Limited; PackageDescription: Chip Capacitor
D2 = Diode BAT18: Low-Loss RF Switching Diode; DistPartNo: BAT54-FDICT-ND; ManPartNo: BAT54-7-F; Note: Pin 2 is not connected and not drawn.; Published: 21-Mar-2003; LatestRevisionDate: 29-May-2009; LatestRevisionNote: IPC-7351 Footprint Added.; DatasheetVersion: Oct-1999; PackageVersion: Sep-2001; PackageReference: SOT-23; Publisher: Altium Limited; PackageDescription: 3-Pin SOT-23 Package 0.95 mm Pitch, 2.5 mm Lead Span; ComponentLink1Description: Manufacturer Link; ComponentLink1URL: http://www.infineon.com/
F2 = Fuse MICROSMD050F-2: POLYSWITCH 0.50A RESET FUSE SMD; DistPartNo: MICROSMD050FCT-ND; ManPartNo: MICROSMD050F-2
H2 = UX60-MB-5ST: USB mini-B; DistPartNo: H2961CT-ND; ManPartNo: UX60A-MB-5ST
Q2 = SI3477: P-Channel MOSFET; DistPartNo: SI3477DV-T1-GE3CT-ND; ManPartNo: SI3477DV-T1-GE3
R59 R61 = Res Chip: Semiconductor Resistor; DistPartNo: P22GCT-ND; ManPartNo: ERJ-3GEYJ220V; Published: 8-Jun-2000; LatestRevisionDate: 17-Jul-2002; LatestRevisionNote: Re-released for DXP Platform.; PackageReference: AXIAL-0.5; Publisher: Altium Limited; PackageDescription: Axial Device, Thru-Hole; 2 Leads; 0.5 in Pin Spacing
R60 = Res Chip: Semiconductor Resistor; DistPartNo: P2.7KGCT-ND; ManPartNo: ERJ-3GEYJ272V; Published: 8-Jun-2000; LatestRevisionDate: 17-Jul-2002; LatestRevisionNote: Re-released for DXP Platform.; PackageReference: AXIAL-0.5; Publisher: Altium Limited; PackageDescription: Axial Device, Thru-Hole; 2 Leads; 0.5 in Pin Spacing
R62 R63 = Res Chip: as R65 on sheet FPGA_IO; Published: 8-Jun-2000; LatestRevisionDate: 17-Jul-2002; LatestRevisionNote: Re-released for DXP Platform.; PackageReference: AXIAL-0.5; Publisher: Altium Limited; PackageDescription: Axial Device, Thru-Hole; 2 Leads; 0.5 in Pin Spacing
R64 = Res Chip: Semiconductor Resistor; DistPartNo: P220KGCT-ND; ManPartNo: ERJ-3GEYJ224V; Published: 8-Jun-2000; LatestRevisionDate: 17-Jul-2002; LatestRevisionNote: Re-released for DXP Platform.; PackageReference: AXIAL-0.5; Publisher: Altium Limited; PackageDescription: Axial Device, Thru-Hole; 2 Leads; 0.5 in Pin Spacing
R92 = Res Chip: as R95 on sheet FPGA_IO; Published: 8-Jun-2000; LatestRevisionDate: 17-Jul-2002; LatestRevisionNote: Re-released for DXP Platform.; PackageReference: AXIAL-0.5; Publisher: Altium Limited; PackageDescription: Axial Device, Thru-Hole; 2 Leads; 0.5 in Pin Spacing
R93 = Res Chip: as R51 on sheet Power; Published: 8-Jun-2000; LatestRevisionDate: 17-Jul-2002; LatestRevisionNote: Re-released for DXP Platform.; PackageReference: AXIAL-0.5; Publisher: Altium Limited; PackageDescription: Axial Device, Thru-Hole; 2 Leads; 0.5 in Pin Spacing
U9 = CP2102: DistPartNo: 336-1160-5-ND; ManPartNo: CP2102-GM
U10 = USBLC6-2: USB ESD Protection; DistPartNo: 497-11882-1-ND; ManPartNo: USBLC6-2SC6Y

## Sheet M3_Chip.SchDoc
size A
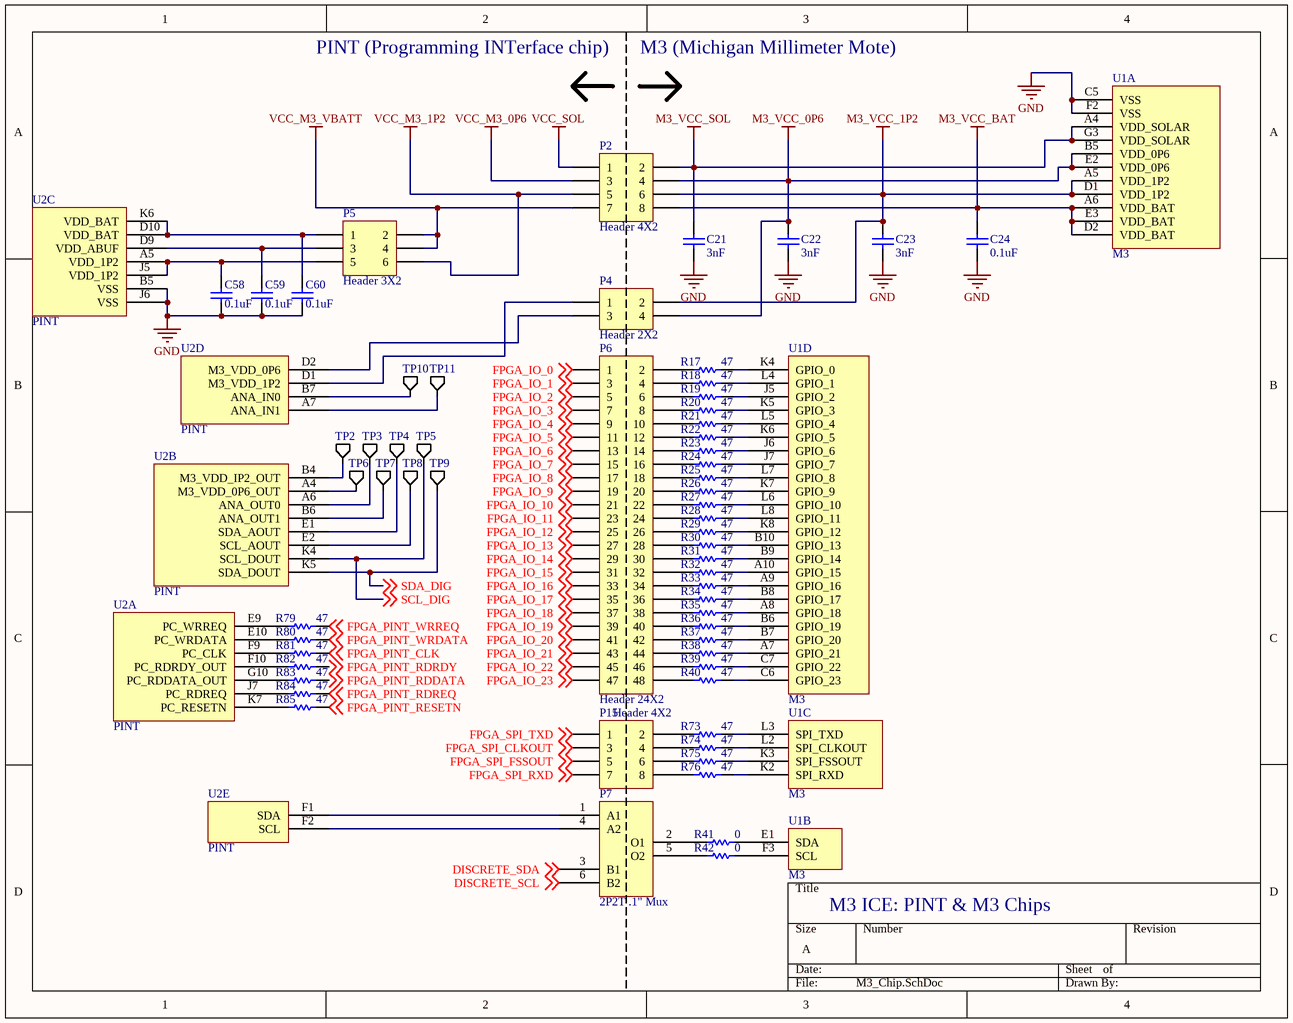
[diagram p4: M3_Chip.SchDoc]

### Parts
C21  value 3nF  [1608[0603]]  (hidden comment: Cap Semi)
C22  value 3nF  [1608[0603]]  (hidden comment: Cap Semi)
C23  value 3nF  [1608[0603]]  (hidden comment: Cap Semi)
C24  value 0.1uF  [1608[0603]]  (hidden comment: Cap Semi)
C58  value 0.1uF  [1608[0603]]  (hidden comment: Cap Semi)
C59  value 0.1uF  [1608[0603]]  (hidden comment: Cap Semi)
C60  value 0.1uF  [1608[0603]]  (hidden comment: Cap Semi)
P2  Header 4X2  [HDR2X4]
P4  Header 2X2  [HDR2X2]
P5  Header 3X2  [HDR2X3]
P6  Header 24X2  [HDR2X24]
P7  2P2T .1" Mux  [HDR3x2]
P15  Header 4X2  [HDR2X4]
R17  value 47  [0603]  (hidden comment: Res Chip)
R18  value 47  [0603]  (hidden comment: Res Chip)
R19  value 47  [0603]  (hidden comment: Res Chip)
R20  value 47  [0603]  (hidden comment: Res Chip)
R21  value 47  [0603]  (hidden comment: Res Chip)
R22  value 47  [0603]  (hidden comment: Res Chip)
R23  value 47  [0603]  (hidden comment: Res Chip)
R24  value 47  [0603]  (hidden comment: Res Chip)
R25  value 47  [0603]  (hidden comment: Res Chip)
R26  value 47  [0603]  (hidden comment: Res Chip)
R27  value 47  [0603]  (hidden comment: Res Chip)
R28  value 47  [0603]  (hidden comment: Res Chip)
R29  value 47  [0603]  (hidden comment: Res Chip)
R30  value 47  [0603]  (hidden comment: Res Chip)
R31  value 47  [0603]  (hidden comment: Res Chip)
R32  value 47  [0603]  (hidden comment: Res Chip)
R33  value 47  [0603]  (hidden comment: Res Chip)
R34  value 47  [0603]  (hidden comment: Res Chip)
R35  value 47  [0603]  (hidden comment: Res Chip)
R36  value 47  [0603]  (hidden comment: Res Chip)
R37  value 47  [0603]  (hidden comment: Res Chip)
R38  value 47  [0603]  (hidden comment: Res Chip)
R39  value 47  [0603]  (hidden comment: Res Chip)
R40  value 47  [0603]  (hidden comment: Res Chip)
R41  value 0  [0603]  (hidden comment: Res Chip)
R42  value 0  [0603]  (hidden comment: Res Chip)
R73  value 47  [0603]  (hidden comment: Res Chip)
R74  value 47  [0603]  (hidden comment: Res Chip)
R75  value 47  [0603]  (hidden comment: Res Chip)
R76  value 47  [0603]  (hidden comment: Res Chip)
R79  value 47  [0603]  (hidden comment: Res Chip)
R80  value 47  [0603]  (hidden comment: Res Chip)
R81  value 47  [0603]  (hidden comment: Res Chip)
R82  value 47  [0603]  (hidden comment: Res Chip)
R83  value 47  [0603]  (hidden comment: Res Chip)
R84  value 47  [0603]  (hidden comment: Res Chip)
R85  value 47  [0603]  (hidden comment: Res Chip)
TP2  TP  [TP]  (value not drawn)
TP3  TP  [TP]  (value not drawn)
TP4  TP  [TP]  (value not drawn)
TP5  TP  [TP]  (value not drawn)
TP6  TP  [TP]  (value not drawn)
TP7  TP  [TP]  (value not drawn)
TP8  TP  [TP]  (value not drawn)
TP9  TP  [TP]  (value not drawn)
TP10  TP  [TP]  (value not drawn)
TP11  TP  [TP]  (value not drawn)
U1  M3  [CPGA-84]  (parts A,B,C,D of 4)
U2  PINT  [CPGA-65]  (parts A,B,C,D,E of 5)

### Nets
GND: C21.1 C22.1 C23.1 C24.1 C58.1 C59.1 C60.1 U1.C5(VSS) U1.F2(VSS) U2.B5(VSS) U2.J6(VSS)
M3_VCC_0P6: C22.2 P2.4 P4.4 U1.B5(VDD_0P6) U1.E2(VDD_0P6)
M3_VCC_1P2: C23.2 P2.6 P4.2 U1.A5(VDD_1P2) U1.D1(VDD_1P2)
M3_VCC_BAT: C24.2 P2.8 U1.A6(VDD_BAT) U1.D2(VDD_BAT) U1.E3(VDD_BAT)
M3_VCC_SOL: C21.2 P2.2 U1.A4(VDD_SOLAR) U1.G3(VDD_SOLAR)
VCC_M3_0P6: P2.3
VCC_M3_1P2: P2.5 P5.6
VCC_M3_VBATT: P2.7 P5.2 P5.4
VCC_SOL: P2.1
DISCRETE_SCL: P7.6(B2) ; off-sheet DISCRETE_SCL
DISCRETE_SDA: P7.3(B1) ; off-sheet DISCRETE_SDA
FPGA_IO_0: P6.1 ; off-sheet FPGA_IO_0
FPGA_IO_1: P6.3 ; off-sheet FPGA_IO_1
FPGA_IO_2: P6.5 ; off-sheet FPGA_IO_2
FPGA_IO_3: P6.7 ; off-sheet FPGA_IO_3
FPGA_IO_4: P6.9 ; off-sheet FPGA_IO_4
FPGA_IO_5: P6.11 ; off-sheet FPGA_IO_5
FPGA_IO_6: P6.13 ; off-sheet FPGA_IO_6
FPGA_IO_7: P6.15 ; off-sheet FPGA_IO_7
FPGA_IO_8: P6.17 ; off-sheet FPGA_IO_8
FPGA_IO_9: P6.19 ; off-sheet FPGA_IO_9
FPGA_IO_10: P6.21 ; off-sheet FPGA_IO_10
FPGA_IO_11: P6.23 ; off-sheet FPGA_IO_11
FPGA_IO_12: P6.25 ; off-sheet FPGA_IO_12
FPGA_IO_13: P6.27 ; off-sheet FPGA_IO_13
FPGA_IO_14: P6.29 ; off-sheet FPGA_IO_14
FPGA_IO_15: P6.31 ; off-sheet FPGA_IO_15
FPGA_IO_16: P6.33 ; off-sheet FPGA_IO_16
FPGA_IO_17: P6.35 ; off-sheet FPGA_IO_17
FPGA_IO_18: P6.37 ; off-sheet FPGA_IO_18
FPGA_IO_19: P6.39 ; off-sheet FPGA_IO_19
FPGA_IO_20: P6.41 ; off-sheet FPGA_IO_20
FPGA_IO_21: P6.43 ; off-sheet FPGA_IO_21
FPGA_IO_22: P6.45 ; off-sheet FPGA_IO_22
FPGA_IO_23: P6.47 ; off-sheet FPGA_IO_23
FPGA_PINT_CLK: R81.1 ; off-sheet FPGA_PINT_CLK
FPGA_PINT_RDDATA: R83.1 ; off-sheet FPGA_PINT_RDDATA
FPGA_PINT_RDRDY: R82.1 ; off-sheet FPGA_PINT_RDRDY
FPGA_PINT_RDREQ: R84.1 ; off-sheet FPGA_PINT_RDREQ
FPGA_PINT_RESETN: R85.1 ; off-sheet FPGA_PINT_RESETN
FPGA_PINT_WRDATA: R80.1 ; off-sheet FPGA_PINT_WRDATA
FPGA_PINT_WRREQ: R79.1 ; off-sheet FPGA_PINT_WRREQ
FPGA_SPI_CLKOUT: P15.3 ; off-sheet FPGA_SPI_CLKOUT
FPGA_SPI_FSSOUT: P15.5 ; off-sheet FPGA_SPI_FSSOUT
FPGA_SPI_RXD: P15.7 ; off-sheet FPGA_SPI_RXD
FPGA_SPI_TXD: P15.1 ; off-sheet FPGA_SPI_TXD
SCL_DIG: TP5.1(A) U2.K4(SCL_DOUT) ; off-sheet SCL_DIG
SDA_DIG: TP9.1(A) U2.K5(SDA_DOUT) ; off-sheet SDA_DIG
NetC58_2: C58.2 P5.5 U2.A5(VDD_1P2) U2.J5(VDD_1P2)
NetC59_2: C59.2 P5.3 U2.D9(VDD_ABUF)
NetC60_2: C60.2 P5.1 U2.D10(VDD_BAT) U2.K6(VDD_BAT)
NetP4_1: P4.1 U2.D1(M3_VDD_1P2)
NetP4_3: P4.3 U2.D2(M3_VDD_0P6)
NetP6_2: P6.2 R17.2
NetP6_4: P6.4 R18.2
NetP6_6: P6.6 R19.2
NetP6_8: P6.8 R20.2
NetP6_10: P6.10 R21.2
NetP6_12: P6.12 R22.2
NetP6_14: P6.14 R23.2
NetP6_16: P6.16 R24.2
NetP6_18: P6.18 R25.2
NetP6_20: P6.20 R26.2
NetP6_22: P6.22 R27.2
NetP6_24: P6.24 R28.2
NetP6_26: P6.26 R29.2
NetP6_28: P6.28 R30.2
NetP6_30: P6.30 R31.2
NetP6_32: P6.32 R32.2
NetP6_34: P6.34 R33.2
NetP6_36: P6.36 R34.2
NetP6_38: P6.38 R35.2
NetP6_40: P6.40 R36.2
NetP6_42: P6.42 R37.2
NetP6_44: P6.44 R38.2
NetP6_46: P6.46 R39.2
NetP6_48: P6.48 R40.2
NetP7_1: P7.1(A1) U2.F1(SDA)
NetP7_2: P7.2(O1) R41.2
NetP7_4: P7.4(A2) U2.F2(SCL)
NetP7_5: P7.5(O2) R42.2
NetP15_2: P15.2 R73.2
NetP15_4: P15.4 R74.2
NetP15_6: P15.6 R75.2
NetP15_8: P15.8 R76.2
NetR17_1: R17.1 U1.K4(GPIO_0)
NetR18_1: R18.1 U1.L4(GPIO_1)
NetR19_1: R19.1 U1.J5(GPIO_2)
NetR20_1: R20.1 U1.K5(GPIO_3)
NetR21_1: R21.1 U1.L5(GPIO_4)
NetR22_1: R22.1 U1.K6(GPIO_5)
NetR23_1: R23.1 U1.J6(GPIO_6)
NetR24_1: R24.1 U1.J7(GPIO_7)
NetR25_1: R25.1 U1.L7(GPIO_8)
NetR26_1: R26.1 U1.K7(GPIO_9)
NetR27_1: R27.1 U1.L6(GPIO_10)
NetR28_1: R28.1 U1.L8(GPIO_11)
NetR29_1: R29.1 U1.K8(GPIO_12)
NetR30_1: R30.1 U1.B10(GPIO_13)
NetR31_1: R31.1 U1.B9(GPIO_14)
NetR32_1: R32.1 U1.A10(GPIO_15)
NetR33_1: R33.1 U1.A9(GPIO_16)
NetR34_1: R34.1 U1.B8(GPIO_17)
NetR35_1: R35.1 U1.A8(GPIO_18)
NetR36_1: R36.1 U1.B6(GPIO_19)
NetR37_1: R37.1 U1.B7(GPIO_20)
NetR38_1: R38.1 U1.A7(GPIO_21)
NetR39_1: R39.1 U1.C7(GPIO_22)
NetR40_1: R40.1 U1.C6(GPIO_23)
NetR41_1: R41.1 U1.E1(SDA)
NetR42_1: R42.1 U1.F3(SCL)
NetR73_1: R73.1 U1.L3(SPI_TXD)
NetR74_1: R74.1 U1.L2(SPI_CLKOUT)
NetR75_1: R75.1 U1.K3(SPI_FSSOUT)
NetR76_1: R76.1 U1.K2(SPI_RXD)
NetR79_2: R79.2 U2.E9(PC_WRREQ)
NetR80_2: R80.2 U2.E10(PC_WRDATA)
NetR81_2: R81.2 U2.F9(PC_CLK)
NetR82_2: R82.2 U2.F10(PC_RDRDY_OUT)
NetR83_2: R83.2 U2.G10(PC_RDDATA_OUT)
NetR84_2: R84.2 U2.J7(PC_RDREQ)
NetR85_2: R85.2 U2.K7(PC_RESETN)
NetTP2_1: TP2.1(A) U2.B4(M3_VDD_IP2_OUT)
NetTP3_1: TP3.1(A) U2.A6(ANA_OUT0)
NetTP4_1: TP4.1(A) U2.E1(SDA_AOUT)
NetTP6_1: TP6.1(A) U2.A4(M3_VDD_0P6_OUT)
NetTP7_1: TP7.1(A) U2.B6(ANA_OUT1)
NetTP8_1: TP8.1(A) U2.E2(SCL_AOUT)
NetTP10_1: TP10.1(A) U2.B7(ANA_IN0)
NetTP11_1: TP11.1(A) U2.A7(ANA_IN1)

### Notes on the sheet
- PINT (Programming INTerface chip)
- M3 (Michigan Millimeter Mote)
- M3 ICE: PINT & M3 Chips

### Library data of the parts
C21-C23 = Cap Semi: Capacitor (Semiconductor SIM Model); DistPartNo: 399-7893-1-ND; ManPartNo: C0603C302K5GACTU; Published: 8-Jun-2000; LatestRevisionDate: 29-May-2009; LatestRevisionNote: IPC-7351 Footprint Added.; PackageReference: C1206; Publisher: Altium Limited; PackageDescription: Chip Capacitor
C24 C58-C60 = Cap Semi: as C26 on sheet Power; Published: 8-Jun-2000; LatestRevisionDate: 29-May-2009; LatestRevisionNote: IPC-7351 Footprint Added.; PackageReference: C1206; Publisher: Altium Limited; PackageDescription: Chip Capacitor
P2 = Header 4X2: Header, 4-Pin, Dual row; DistPartNo: A26530-40-ND; ManPartNo: 4-103328-0; LatestRevisionDate: 17-Jul-2002; LatestRevisionNote: Re-released for DXP Platform.; Publisher: Altium Limited
P4 = Header 2X2: Header, 2-Pin, Dual row; LatestRevisionDate: 17-Jul-2002; LatestRevisionNote: Re-released for DXP Platform.; Publisher: Altium Limited
P5 = Header 3X2: Header, 3-Pin, Dual row; LatestRevisionDate: 17-Jul-2002; LatestRevisionNote: Re-released for DXP Platform.; Publisher: Altium Limited
P6 = Header 24X2: Header, 24-Pin, Dual row; DistPartNo: A26530-40-ND; ManPartNo: 4-103328-0; LatestRevisionDate: 17-Jul-2002; LatestRevisionNote: Re-released for DXP Platform.; Publisher: Altium Limited
P15 = Header 4X2: Header, 4-Pin, Dual row; LatestRevisionDate: 17-Jul-2002; LatestRevisionNote: Re-released for DXP Platform.; Publisher: Altium Limited
R17-R40 R73-R76 R79-R85 = Res Chip: Semiconductor Resistor; DistPartNo: P47GCT-ND; ManPartNo: ERJ-3GEYJ470V; Published: 8-Jun-2000; LatestRevisionDate: 17-Jul-2002; LatestRevisionNote: Re-released for DXP Platform.; PackageReference: AXIAL-0.5; Publisher: Altium Limited; PackageDescription: Axial Device, Thru-Hole; 2 Leads; 0.5 in Pin Spacing
R41 R42 = Res Chip: Semiconductor Resistor; DistPartNo: P0.0GCT-ND; ManPartNo: ERJ-3GEY0R00V; Published: 8-Jun-2000; LatestRevisionDate: 17-Jul-2002; LatestRevisionNote: Re-released for DXP Platform.; PackageReference: AXIAL-0.5; Publisher: Altium Limited; PackageDescription: Axial Device, Thru-Hole; 2 Leads; 0.5 in Pin Spacing
U1 = M3: DistPartNo: 3M5067-ND; ManPartNo: 200-6311-9UN-1900
U2 = PINT: DistPartNo: 3M5066-ND; ManPartNo: 200-6310-9UN-1900

## Nets that join several sheets
GND: FPGA_IO (27 pins), Power (39 pins), FPGA_misc (36 pins), USB_to_UART (19 pins), M3_Chip (11 pins)
VCC_1P2: Power (6 pins), FPGA_misc (21 pins)
VCC_B0: FPGA_IO (13 pins), Power (C34.2 P11.1 TP17.1), FPGA_misc (14 pins)
VCC_M3_0P6: Power (S7.2 TP21.1), M3_Chip (P2.3)
VCC_M3_1P2: Power (S5.2 TP16.1), M3_Chip (P2.5 P5.6)
VCC_M3_VBATT: Power (S6.2 TP14.1), M3_Chip (P2.7 P5.2 P5.4)
VCC_PRE: FPGA_IO (R12.1 U3.4), Power (20 pins)
VCC_SOL: Power (TP27.1), M3_Chip (P2.1)
VCC_USB: Power (P8.2 TP19.1), USB_to_UART (11 pins)
FPGA_IO_0: FPGA_IO (F1.63), M3_Chip (P6.1)
FPGA_IO_1: FPGA_IO (F1.62), M3_Chip (P6.3)
FPGA_IO_2: FPGA_IO (F1.61), M3_Chip (P6.5)
FPGA_IO_3: FPGA_IO (F1.60), M3_Chip (P6.7)
FPGA_IO_4: FPGA_IO (F1.59), M3_Chip (P6.9)
FPGA_IO_5: FPGA_IO (F1.58), M3_Chip (P6.11)
FPGA_IO_6: FPGA_IO (F1.57), M3_Chip (P6.13)
FPGA_IO_7: FPGA_IO (F1.45), M3_Chip (P6.15)
FPGA_IO_8: FPGA_IO (F1.44), M3_Chip (P6.17)
FPGA_IO_9: FPGA_IO (F1.43), M3_Chip (P6.19)
FPGA_IO_10: FPGA_IO (F1.42), M3_Chip (P6.21)
FPGA_IO_11: FPGA_IO (F1.41), M3_Chip (P6.23)
FPGA_IO_12: FPGA_IO (F1.40), M3_Chip (P6.25)
FPGA_IO_13: FPGA_IO (F1.36), M3_Chip (P6.27)
FPGA_IO_14: FPGA_IO (F1.35), M3_Chip (P6.29)
FPGA_IO_15: FPGA_IO (F1.34), M3_Chip (P6.31)
FPGA_IO_16: FPGA_IO (F1.33), M3_Chip (P6.33)
FPGA_IO_17: FPGA_IO (F1.32), M3_Chip (P6.35)
FPGA_IO_18: FPGA_IO (F1.31), M3_Chip (P6.37)
FPGA_IO_19: FPGA_IO (F1.30), M3_Chip (P6.39)
FPGA_IO_20: FPGA_IO (F1.29), M3_Chip (P6.41)
FPGA_IO_21: FPGA_IO (F1.28), M3_Chip (P6.43)
FPGA_IO_22: FPGA_IO (F1.27), M3_Chip (P6.45)
FPGA_IO_23: FPGA_IO (F1.26), M3_Chip (P6.47)
FPGA_PINT_CLK: FPGA_IO (F1.69), M3_Chip (R81.1)
FPGA_PINT_RDDATA: FPGA_IO (F1.71), M3_Chip (R83.1)
FPGA_PINT_RDRDY: FPGA_IO (F1.70), M3_Chip (R82.1)
FPGA_PINT_RDREQ: FPGA_IO (F1.72), M3_Chip (R84.1)
FPGA_PINT_RESETN: FPGA_IO (F1.73), M3_Chip (R85.1)
FPGA_PINT_WRDATA: FPGA_IO (F1.65), M3_Chip (R80.1)
FPGA_PINT_WRREQ: FPGA_IO (F1.64), M3_Chip (R79.1)
M3_0P6_ON: FPGA_IO (F1.8 R95.1), Power (U4.9)
M3_1P2_ON: FPGA_IO (F1.7 R96.1), Power (U4.11)
M3_VBATT_ON: FPGA_IO (F1.6 R97.1), Power (U4.13)
PMU_ON: Power (U4.20), USB_to_UART (R93.2)
PMU_SCL: FPGA_IO (F1.5), Power (R86.1 U4.31)
PMU_SDA: FPGA_IO (F1.4), Power (R58.1 U4.30)
SCL_DIG: FPGA_IO (F1.10), M3_Chip (TP5.1 U2.K4)
SDA_DIG: FPGA_IO (F1.11), M3_Chip (TP9.1 U2.K5)
SYS_CLK: FPGA_IO (F1.98), FPGA_misc (TP1.1 X1.3)
USB_UART_RXD: FPGA_IO (F1.97), USB_to_UART (U9.25)
USB_UART_TXD: FPGA_IO (F1.96), USB_to_UART (U9.26)